# Altium schematic sheet 网关模块8266_1278.SchDoc
size A3
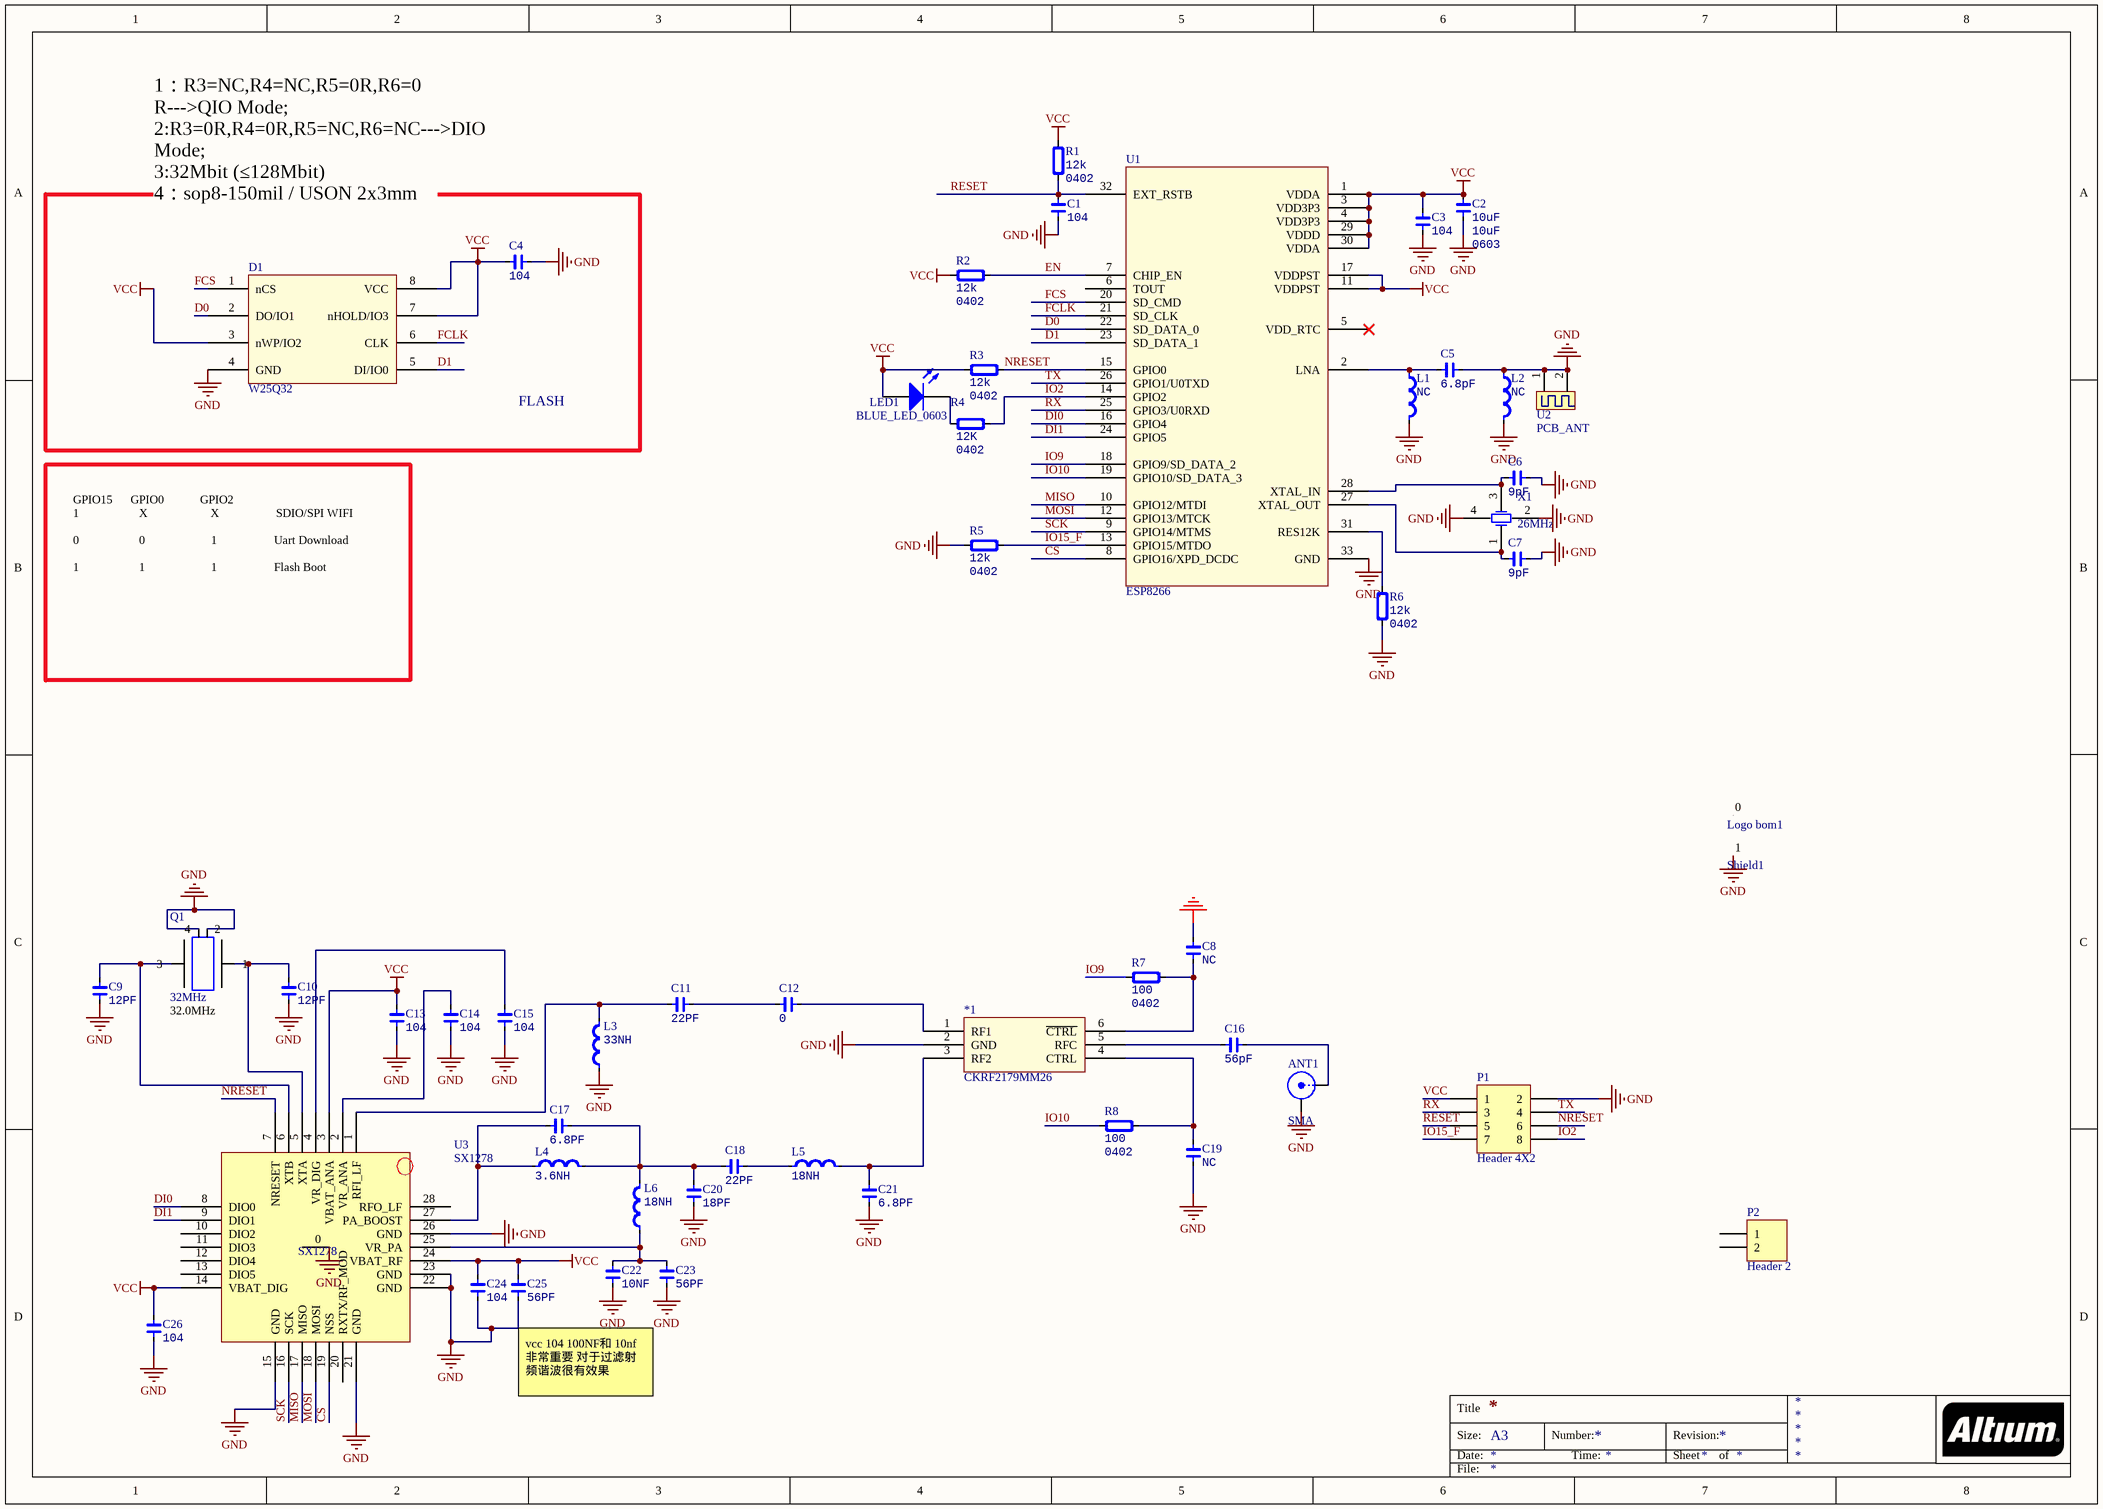
[diagram p0: 网关模块8266_1278.SchDoc]

## Parts
*1  CKRF2179MM26  [SC70-6]
ANT1  SMA  [SMA_EDGE]
C1  104  [CAP_0402]
C2  10uF  Type: 0603  [CAP_0603]
C3  104  [CAP_0402]
C4  104  [CAP_0402]
C5  6.8pF  [CAP_0402]
C6  9pF  [CAP_0402]
C7  9pF  [CAP_0402]
C8  NC  [CAP_0402]
C9  12PF  [CAP_0402]
C10  12PF  [CAP_0402]
C11  22PF  [CAP_0402]
C12  0  [CAP_0402]
C13  104  [CAP_0402]
C14  104  [CAP_0402]
C15  104  [CAP_0402]
C16  56pF  [CAP_0402]
C17  6.8PF  [CAP_0402]
C18  22PF  [CAP_0402]
C19  NC  [CAP_0402]
C20  18PF  [CAP_0402]
C21  6.8PF  [CAP_0402]
C22  10NF  [CAP_0402]
C23  56PF  [CAP_0402]
C24  104  [CAP_0402]
C25  56PF  [CAP_0402]
C26  104  [CAP_0402]
D1  W25Q32  [W25Q128-1]
L1  NC  [IND_0402]
L2  NC  [IND_0402]
L3  33NH  [IND_0402]
L4  3.6NH  [IND_0402]
L5  18NH  [IND_0402]
L6  18NH  [IND_0402]
LED1  BLUE_LED_0603  [SMDLED]
Logo_bom1  Logo symbol  [logo1]  (value not drawn)
P1  Header 4X2  [MY HDR 2X4]
P2  Header 2  [HDR1X2]
Q1  32MHz  value 32.0MHz  [3325]
R1  Type: 0402  [RES_0402]  (hidden comment: 12K)
R2  Type: 0402  [RES_0402]  (hidden comment: 12K)
R3  Type: 0402  [RES_0402]  (hidden comment: 12K)
R4  value 12K  Type: 0402  [RES_0402]  (hidden comment: 820)
R5  Type: 0402  [RES_0402]  (hidden comment: 12K)
R6  Type: 0402  [RES_0402]  (hidden comment: 12K)
R7  Type: 0402  [RES_0402]  (hidden comment: 100)
R8  Type: 0402  [RES_0402]  (hidden comment: 100)
Shield1  Logo symbol  [24*18_8266]  (value not drawn)
U1  ESP8266  [ESP8266]
U2  PCB_ANT  [BLE-ANT4]
U3  SX1278  [QFN-28]
X1  26MHz  [CY_3225]

## Blocks framed on the sheet
FLASH: C4 D1

## Nets
GND: *1.2(GND) ANT1.2(GND) C1.1 C2.1 C3.1 C4.2 C5.1 C6.1 C7.1 C8.1 C9.1 C10.1 C13.1 C14.1 C15.1 C19.2 C20.1 C21.1 C22.1 C23.1 C24.1 C25.1 C26.2 D1.4(GND) L1.2 L2.1 L2.2 L3.1 P1.2 Q1.2 Q1.4 R5.2 R6.2 Shield1.1 U1.33(GND) U2.1 U2.2 U3.0 U3.15(GND) U3.21(GND) U3.22(GND) U3.23(GND) U3.26(GND) X1.2(OSC2) X1.4(OSC2)
VCC: C2.2 C3.2 C4.1 C13.2 C24.2 C25.2 C26.1 D1.3(nWP/IO2) D1.7(nHOLD/IO3) D1.8(VCC) LED1.1(A) P1.1 R1.2 R2.2 R3.2 U1.1(VDDA) U1.3(VDD3P3) U1.4(VDD3P3) U1.11(VDDPST) U1.17(VDDPST) U1.29(VDDD) U1.30(VDDA) U3.3(VBAT_ANA) U3.14(VBAT_DIG) U3.24(VBAT_RF)
CS: U1.8(GPIO16/XPD_DCDC) U3.19(NSS)
D0: D1.2(DO/IO1) U1.22(SD_DATA_0)
D1: D1.5(DI/IO0) U1.23(SD_DATA_1)
DI0: U1.16(GPIO4) U3.8(DIO0)
DI1: U1.24(GPIO5) U3.9(DIO1)
EN: R2.1 U1.7(CHIP_EN)
FCLK: D1.6(CLK) U1.21(SD_CLK)
FCS: D1.1(nCS) U1.20(SD_CMD)
IO2: P1.8 R4.1 U1.14(GPIO2)
IO9: R7.1 U1.18(GPIO9/SD_DATA_2)
IO10: R8.1 U1.19(GPIO10/SD_DATA_3)
IO15_F: P1.7 R5.1 U1.13(GPIO15/MTDO)
MISO: U1.10(GPIO12/MTDI) U3.17(MISO)
MOSI: U1.12(GPIO13/MTCK) U3.18(MOSI)
NRESET: P1.6 R3.1 U1.15(GPIO0) U3.7(NRESET)
RESET: C1.2 P1.5 R1.1 U1.32(EXT_RSTB)
RX: P1.3 U1.25(GPIO3/U0RXD)
SCK: U1.9(GPIO14/MTMS) U3.16(SCK)
TX: P1.4 U1.26(GPIO1/U0TXD)
Net*1_1: *1.1(RF1) C12.1
Net*1_3: *1.3(RF2) C21.2 L5.2
Net*1_4: *1.4(CTRL) C19.1 R8.2
Net*1_5: *1.5(RFC) C16.2
Net*1_6: *1.6(~{CTRL}) C8.2 R7.2
NetANT1_1: ANT1.1(Signal) C16.1
NetC5_2: C5.2 L1.1 U1.2(LNA)
NetC6_2: C6.2 U1.28(XTAL_IN) X1.3(OSC2)
NetC7_2: C7.2 U1.27(XTAL_OUT) X1.1(OSC1)
NetC9_2: C9.2 Q1.3 U3.6(XTB)
NetC10_2: C10.2 Q1.1 U3.5(XTA)
NetC11_1: C11.1 C12.2
NetC11_2: C11.2 L3.2 U3.1(RFI_LF)
NetC14_2: C14.2 U3.2(VR_ANA)
NetC15_2: C15.2 U3.4(VR_DIG)
NetC17_1: C17.1 C18.2 C20.2 L4.2 L6.2
NetC17_2: C17.2 L4.1 U3.27(PA_BOOST)
NetC18_1: C18.1 L5.1
NetC22_2: C22.2 C23.2 L6.1 U3.25(VR_PA)
NetLED1_2: LED1.2(K) R4.2
NetR6_1: R6.1 U1.31(RES12K)

Not connected (* = marked no-connect by the designer): Logo_bom1 0; P2 1 2; U1 5(VDD_RTC)* 6(TOUT); U3 10(DIO2) 11(DIO3) 12(DIO4) 13(DIO5) 20(RXTX/RF_MOD) 28(RFO_LF)

## Notes on the sheet
- 1：R3=NC,R4=NC,R5=0R,R6=0 R--->QIO Mode;
  2:R3=0R,R4=0R,R5=NC,R6=NC--->DIO Mode;
  3:32Mbit (≤128Mbit)
  4：sop8-150mil / USON 2x3mm
- GPIO15      GPIO0            GPIO2
  1                    X                     X                   SDIO/SPI WIFI
  0                    0                      1                   Uart Download
  1                    1                      1                   Flash Boot
- vcc 104 100NF和 10nf  非常重要 对于过滤射频谐波很有效果
- Title
- Size:
- Date:
- A3
- Number:
- Time:
- Revision:
- Sheet
- of
- File:

## Library data of the parts
*1 = PE4259
ANT1 = SMA: SMA Straight Connector; LatestRevisionDate: 05-oct-2007  -  Semtech; LatestRevisionNote: Re-released for DXP Platform.; Publisher: Altium Limited
C1 C3-C26 = Cap_0402: Capacitor; Value: ?F; Type: 0402
C2 = Cap_0603: Capacitor; Value: 10uF
D1 = W25Q128
L1-L6 = Ind_0402: Inductor; Type: 0402
  L1 L2: Value: NC
  L3: Value: 33NH
  L4: Value: 3.6NH
  L5 L6: Value: 18NH
LED1 = LED2: Typical RED, GREEN, YELLOW, AMBER GaAs LED; Published: 8-Jun-2000; LatestRevisionDate: 17-Jul-2002; LatestRevisionNote: Re-released for DXP Platform.; PackageDocument: Feb-2002; PackageReference: 3.2X1.6X1.1; Publisher: Altium Limited
Logo_bom1 = Logo: qc symbol for Logo
P1 = Header 4X2: Header, 4-Pin, Dual row; LatestRevisionDate: 17-Jul-2002; LatestRevisionNote: Re-released for DXP Platform.; Publisher: Altium Limited
P2 = Header 2: Header, 2-Pin; LatestRevisionDate: 17-Jul-2002; LatestRevisionNote: Re-released for DXP Platform.; Publisher: Altium Limited
Q1 = Xtal GND: 32M无源晶振 10PPM   年老化3ppm以内; LatestRevisionDate: 05-oct-2007  -  Semtech
R1-R8 = Res_0402: Resistor
  R1-R3 R5 R6: Value: 12k
  R7 R8: Value: 100
Shield1 = Shield: Shield - EMI Gasket - Standard Surface Mount Shields
U2 = 天线
X1 = XTAL: 24M无源晶振（10ppm）; Published: 8-Jun-2000; LatestRevisionDate: 17-Jul-2002; LatestRevisionNote: Re-released for DXP Platform.; PackageReference: R38; Publisher: Altium Limited